# Altium schematic sheet DBL 165 ShiftIn Red - TestButtonsPlate.SchDoc
size A4
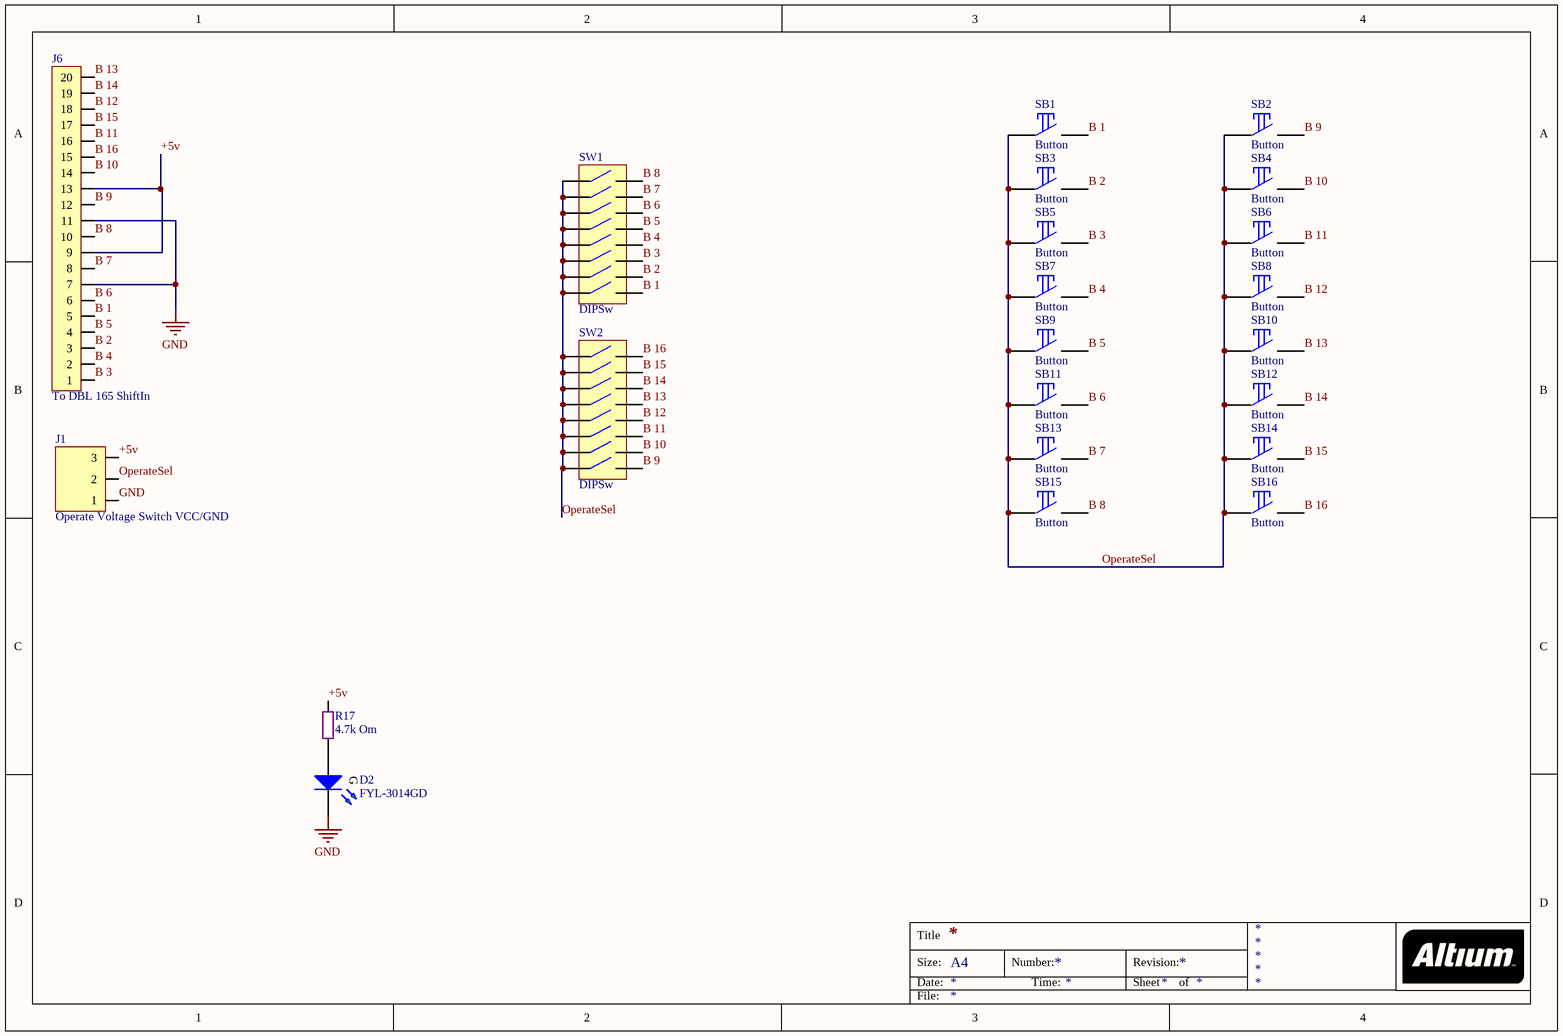
[diagram p0: DBL 165 ShiftIn Red - TestButtonsPlate.SchDoc]

## Parts
D2  FYL-3014GD  [LED Round 3mm Green]
J1  Operate Voltage Switch VCC/GND  [Line 2.54 X 3]
J6  To DBL 165 ShiftIn  [LINE 2.54 x 20D (2 x 10) - BH]
R17  4.7k Om  [SMD 0805 (2012)]
SB1  Button  [Switch Button 2P]
SB2  Button  [Switch Button 2P]
SB3  Button  [Switch Button 2P]
SB4  Button  [Switch Button 2P]
SB5  Button  [Switch Button 2P]
SB6  Button  [Switch Button 2P]
SB7  Button  [Switch Button 2P]
SB8  Button  [Switch Button 2P]
SB9  Button  [Switch Button 2P]
SB10  Button  [Switch Button 2P]
SB11  Button  [Switch Button 2P]
SB12  Button  [Switch Button 2P]
SB13  Button  [Switch Button 2P]
SB14  Button  [Switch Button 2P]
SB15  Button  [Switch Button 2P]
SB16  Button  [Switch Button 2P]
SW1  DIPSw  [DIP Switch 8p]
SW2  DIPSw  [DIP Switch 8p]

## Nets
GND: D2.K J1.1 J6.7 J6.11
+5v: J1.3 J6.9 J6.13 R17.1
B 1: J6.5 SB1.2 SW1.16
B 2: J6.3 SB3.2 SW1.14
B 3: J6.1 SB5.2 SW1.12
B 4: J6.2 SB7.2 SW1.10
B 5: J6.4 SB9.2 SW1.8
B 6: J6.6 SB11.2 SW1.6
B 7: J6.8 SB13.2 SW1.4
B 8: J6.10 SB15.2 SW1.2
B 9: J6.12 SB2.2 SW2.16
B 10: J6.14 SB4.2 SW2.14
B 11: J6.16 SB6.2 SW2.12
B 12: J6.18 SB8.2 SW2.10
B 13: J6.20 SB10.2 SW2.8
B 14: J6.19 SB12.2 SW2.6
B 15: J6.17 SB14.2 SW2.4
B 16: J6.15 SB16.2 SW2.2
OperateSel: J1.2 SB1.1 SB2.1 SB3.1 SB4.1 SB5.1 SB6.1 SB7.1 SB8.1 SB9.1 SB10.1 SB11.1 SB12.1 SB13.1 SB14.1 SB15.1 SB16.1 SW1.1 SW1.3 SW1.5 SW1.7 SW1.9 SW1.11 SW1.13 SW1.15 SW2.1 SW2.3 SW2.5 SW2.7 SW2.9 SW2.11 SW2.13 SW2.15
NetD2_A: D2.A R17.2

## Notes on the sheet
- Title
- Size:
- Date:
- A4
- Number:
- Time:
- Revision:
- Sheet
- of
- File:
- (in symbol Led Round 3mm Green) G

## Library data of the parts
D2 = Led Round 3mm Green: 2.1v 10mA, 15-30mCd; Forward Voltage Max: 2.3; Forward Voltage TYP: 2.1; Wave len min/typ: 570nm; Liminous Typ (mcd): 15-30; Forward Amp (mA): 10; Color: Green; Name: FYL-3014GD
J1 = PLS-3: Vert, Sgl line, Male
J6 = PLD-20 (2 x 10): Vert, Dbl line, Male
R17 = Res All Types
SB1-SB16 = Button: Tact button
SW1 SW2 = DIP Switch 8pos